# Altium schematic sheet RADAR.SchDoc (part 1 of 3)
size Letter; DrawnBy: Titan Yuan; DocumentNumber: 1; SheetNumber: 1; SheetTotal: 7
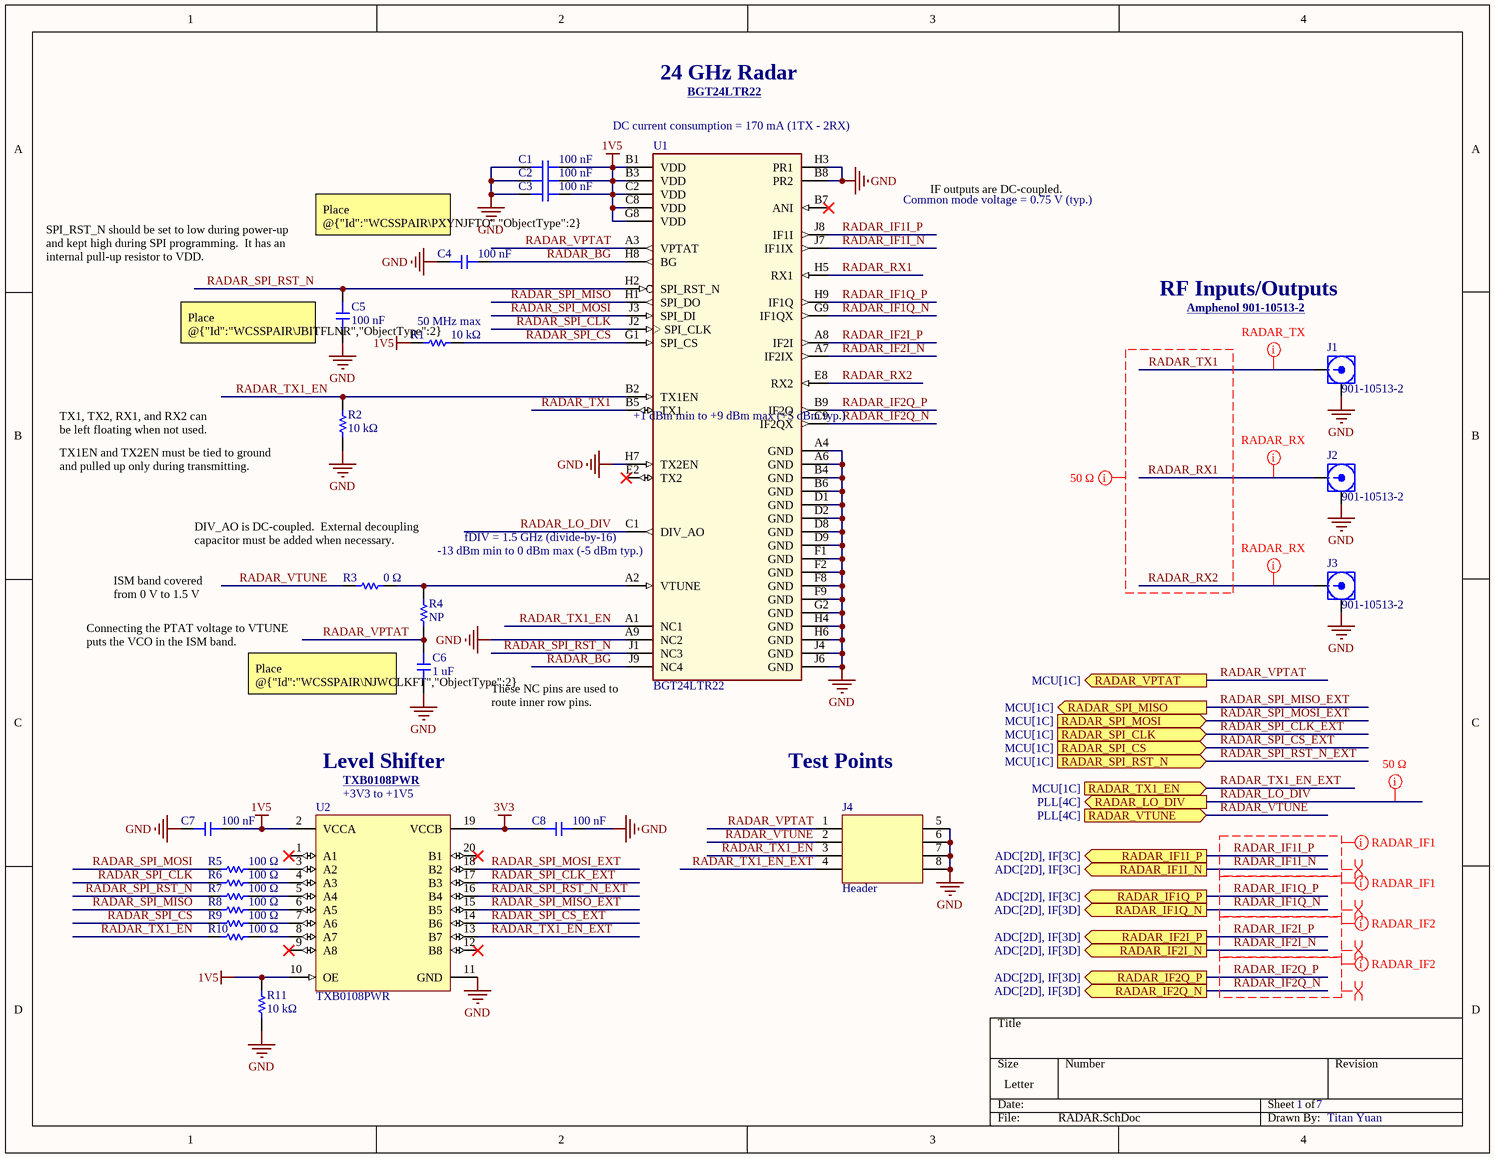
[diagram p0: RADAR.SchDoc]

## Parts
C1  100 nF  [CAP_0402]
C2  100 nF  [CAP_0402]
C3  100 nF  [CAP_0402]
C4  100 nF  [CAP_0402]
C5  100 nF  [CAP_0402]
C6  1 uF  [CAP_0603]
C7  100 nF  [CAP_0402]
C8  100 nF  [CAP_0402]
J1  901-10513-2  [901-10513-2]
J2  901-10513-2  [901-10513-2]
J3  901-10513-2  [901-10513-2]
J4  Header  [CONN_2x4_2.54mm_PinHeader_Vertical]
R1  10 kΩ  [RES_0402]
R2  10 kΩ  [RES_0402]
R3  0 Ω  [RES_0603]
R4  NP  [RES_0603]
R5  100 Ω  [RES_0402]
R6  100 Ω  [RES_0402]
R7  100 Ω  [RES_0402]
R8  100 Ω  [RES_0402]
R9  100 Ω  [RES_0402]
R10  100 Ω  [RES_0402]
R11  10 kΩ  [RES_0402]
U1  BGT24LTR22  [BGA52C40P9X9_363X363X80-V]
U2  TXB0108PWR  [TXB0108PWR]

## Ports
RADAR_IF1I_N (out, see ADC[2D], IF[3C]), RADAR_IF1I_P (out, see ADC[2D], IF[3C]), RADAR_IF1Q_N (out, see ADC[2D], IF[3D]), RADAR_IF1Q_P (out, see ADC[2D], IF[3C]), RADAR_IF2I_N (out, see ADC[2D], IF[3D]), RADAR_IF2I_P (out, see ADC[2D], IF[3D]), RADAR_IF2Q_N (out, see ADC[2D], IF[3D]), RADAR_IF2Q_P (out, see ADC[2D], IF[3D]), RADAR_LO_DIV (out, see PLL[4C]), RADAR_SPI_CLK (in, see MCU[1C]), RADAR_SPI_CS (in, see MCU[1C]), RADAR_SPI_MISO (out, see MCU[1C]), RADAR_SPI_MOSI (in, see MCU[1C]), RADAR_SPI_RST_N (in, see MCU[1C]), RADAR_TX1_EN (in, see MCU[1C]), RADAR_VPTAT (out, see MCU[1C]), RADAR_VTUNE (in, see PLL[4C])

## Nets
1V5: C1.2 C2.2 C3.2 C7.1 R1.2 R11.1 U1.B1(VDD) U1.B3(VDD) U1.C2(VDD) U1.C8(VDD) U1.G8(VDD) U2.2(VCCA) U2.10(OE)
3V3: C8.2 U2.19(VCCB)
GND: C1.1 C2.1 C3.1 C4.1 C5.1 C6.1 C7.2 C8.1 J1.2 J2.2 J3.2 J4.5 J4.6 J4.7 J4.8 R2.1 R11.2 U1.A4(GND) U1.A6(GND) U1.A9(NC2) U1.B4(GND) U1.B6(GND) U1.B8(PR2) U1.D1(GND) U1.D2(GND) U1.D8(GND) U1.D9(GND) U1.F1(GND) U1.F2(GND) U1.F8(GND) U1.F9(GND) U1.G2(GND) U1.H3(PR1) U1.H4(GND) U1.H6(GND) U1.H7(TX2EN) U1.J4(GND) U1.J6(GND) U2.11(GND)
RADAR_BG: C4.2 U1.H8(BG) U1.J9(NC4)
RADAR_IF1I_N: U1.J7(IF1IX) ; port RADAR_IF1I_N
RADAR_IF1I_P: U1.J8(IF1I) ; port RADAR_IF1I_P
RADAR_IF1Q_N: U1.G9(IF1QX) ; port RADAR_IF1Q_N
RADAR_IF1Q_P: U1.H9(IF1Q) ; port RADAR_IF1Q_P
RADAR_IF2I_N: U1.A7(IF2IX) ; port RADAR_IF2I_N
RADAR_IF2I_P: U1.A8(IF2I) ; port RADAR_IF2I_P
RADAR_IF2Q_N: U1.C9(IF2QX) ; port RADAR_IF2Q_N
RADAR_IF2Q_P: U1.B9(IF2Q) ; port RADAR_IF2Q_P
RADAR_LO_DIV: U1.C1(DIV_AO) ; port RADAR_LO_DIV
RADAR_RX1: J2.1 U1.H5(RX1)
RADAR_RX2: J3.1 U1.E8(RX2)
RADAR_SPI_CLK: R6.2 U1.J2(SPI_CLK)
RADAR_SPI_CLK_EXT: U2.17(B3) ; port RADAR_SPI_CLK
RADAR_SPI_CS: R1.1 R9.2 U1.G1(SPI_CS)
RADAR_SPI_CS_EXT: U2.14(B6) ; port RADAR_SPI_CS
RADAR_SPI_MISO: R8.2 U1.H1(SPI_DO)
RADAR_SPI_MISO_EXT: U2.15(B5) ; port RADAR_SPI_MISO
RADAR_SPI_MOSI: R5.2 U1.J3(SPI_DI)
RADAR_SPI_MOSI_EXT: U2.18(B2) ; port RADAR_SPI_MOSI
RADAR_SPI_RST_N: C5.2 R7.2 U1.H2(SPI_RST_N) U1.J1(NC3)
RADAR_SPI_RST_N_EXT: U2.16(B4) ; port RADAR_SPI_RST_N
RADAR_TX1: J1.1 U1.B5(TX1)
RADAR_TX1_EN: J4.3 R2.2 R10.2 U1.A1(NC1) U1.B2(TX1EN)
RADAR_TX1_EN_EXT: J4.4 U2.13(B7) ; port RADAR_TX1_EN
RADAR_VPTAT: C6.2 J4.1 R4.1 U1.A3(VPTAT) ; port RADAR_VPTAT
RADAR_VTUNE: J4.2 R3.2 ; port RADAR_VTUNE
NetR3_1: R3.1 R4.2 U1.A2(VTUNE)
NetR5_1: R5.1 U2.3(A2)
NetR6_1: R6.1 U2.4(A3)
NetR7_1: R7.1 U2.5(A4)
NetR8_1: R8.1 U2.6(A5)
NetR9_1: R9.1 U2.7(A6)
NetR10_1: R10.1 U2.8(A7)

Not connected (* = marked no-connect by the designer): U1 B7(ANI)* E2(TX2)*; U2 1(A1)* 9(A8)* 12(B8)* 20(B1)*

## Layout directives
rule Matched Net Lengths [Tolerance = 1mil]; net class RADAR_RX: RADAR_RX1, RADAR_RX2
net class RADAR_TX; rule Matched Net Lengths [Tolerance = 1mil]: RADAR_TX1
net class 50 Ω: RADAR_LO_DIV, RADAR_RX1, RADAR_RX2, RADAR_TX1
differential pair: RADAR_IF1I_N, RADAR_IF1I_P, RADAR_IF1Q_N, RADAR_IF1Q_P, RADAR_IF2I_N, RADAR_IF2I_P, RADAR_IF2Q_N, RADAR_IF2Q_P
mark named RADAR_IF1: RADAR_IF1I_N, RADAR_IF1I_P, RADAR_IF1Q_N, RADAR_IF1Q_P
mark named RADAR_IF2: RADAR_IF2I_N, RADAR_IF2I_P, RADAR_IF2Q_N, RADAR_IF2Q_P

## Notes on the sheet
- 24 GHz Radar
- BGT24LTR22 <https://www.infineon.com/part/BGT24LTR22>
- (near U1) DC current consumption = 170 mA (1TX - 2RX)
- (near C4) Place @{"Id":"WCSSPAIR\PXYNJFTO","ObjectType":2} as close to the device as possible.
- Common mode voltage = 0.75 V (typ.)
- IF outputs are DC-coupled.
- SPI_RST_N should be set to low during power-up and kept high during SPI programming.  It has an internal pull-up resistor to VDD.
- RF Inputs/Outputs
- (near C5) Place @{"Id":"WCSSPAIR\JBITFLNR","ObjectType":2} as close to the device as possible.
- (near R1) 50 MHz max
- Amphenol 901-10513-2 <https://www.amphenolrf.com/901-10513-2.html>
- TX1, TX2, RX1, and RX2 can be left floating when not used.
- (near U1) +1 dBm min to +9 dBm max (+5 dBm typ.)
- TX1EN and TX2EN must be tied to ground and pulled up only during transmitting.
- DIV_AO is DC-coupled.  External decoupling capacitor must be added when necessary.
- (near U1) -13 dBm min to 0 dBm max (-5 dBm typ.)
- (near U1) fDIV = 1.5 GHz (divide-by-16)
- Connecting the PTAT voltage to VTUNE puts the VCO in the ISM band.
- ISM band covered from 0 V to 1.5 V
- Place @{"Id":"WCSSPAIR\NJWCLKFT","ObjectType":2} as close to the VTUNE pin as possible.
- (near U1) These NC pins are used to route inner row pins.
- Level Shifter
- Test Points
- (near U2) +3V3 to +1V5
- (near U2) TXB0108PWR <https://www.ti.com/product/TXB0108>